# Altium schematic sheet 28Pins_Project_V1I1 Project.SchDoc
size A3; DocumentNumber: 5; SheetNumber: 5; SheetTotal: 5; PageSetup: Record=PageOptions|CenterHorizontal=True|CenterVertical=True|PrintScale=1.07|XCorrection=1.00|YCorrection=1.00|PrintKind=1|BorderSize=5000000|LeftOffset=0|BottomOffset=0|Orientation=2|PaperLength=1000|PaperWidth=1000|Scale=100|PaperSource=7|PrintQuality=600|MediaType=1|DitherType=10|PaperKind=A3|PrintScaleMode=1
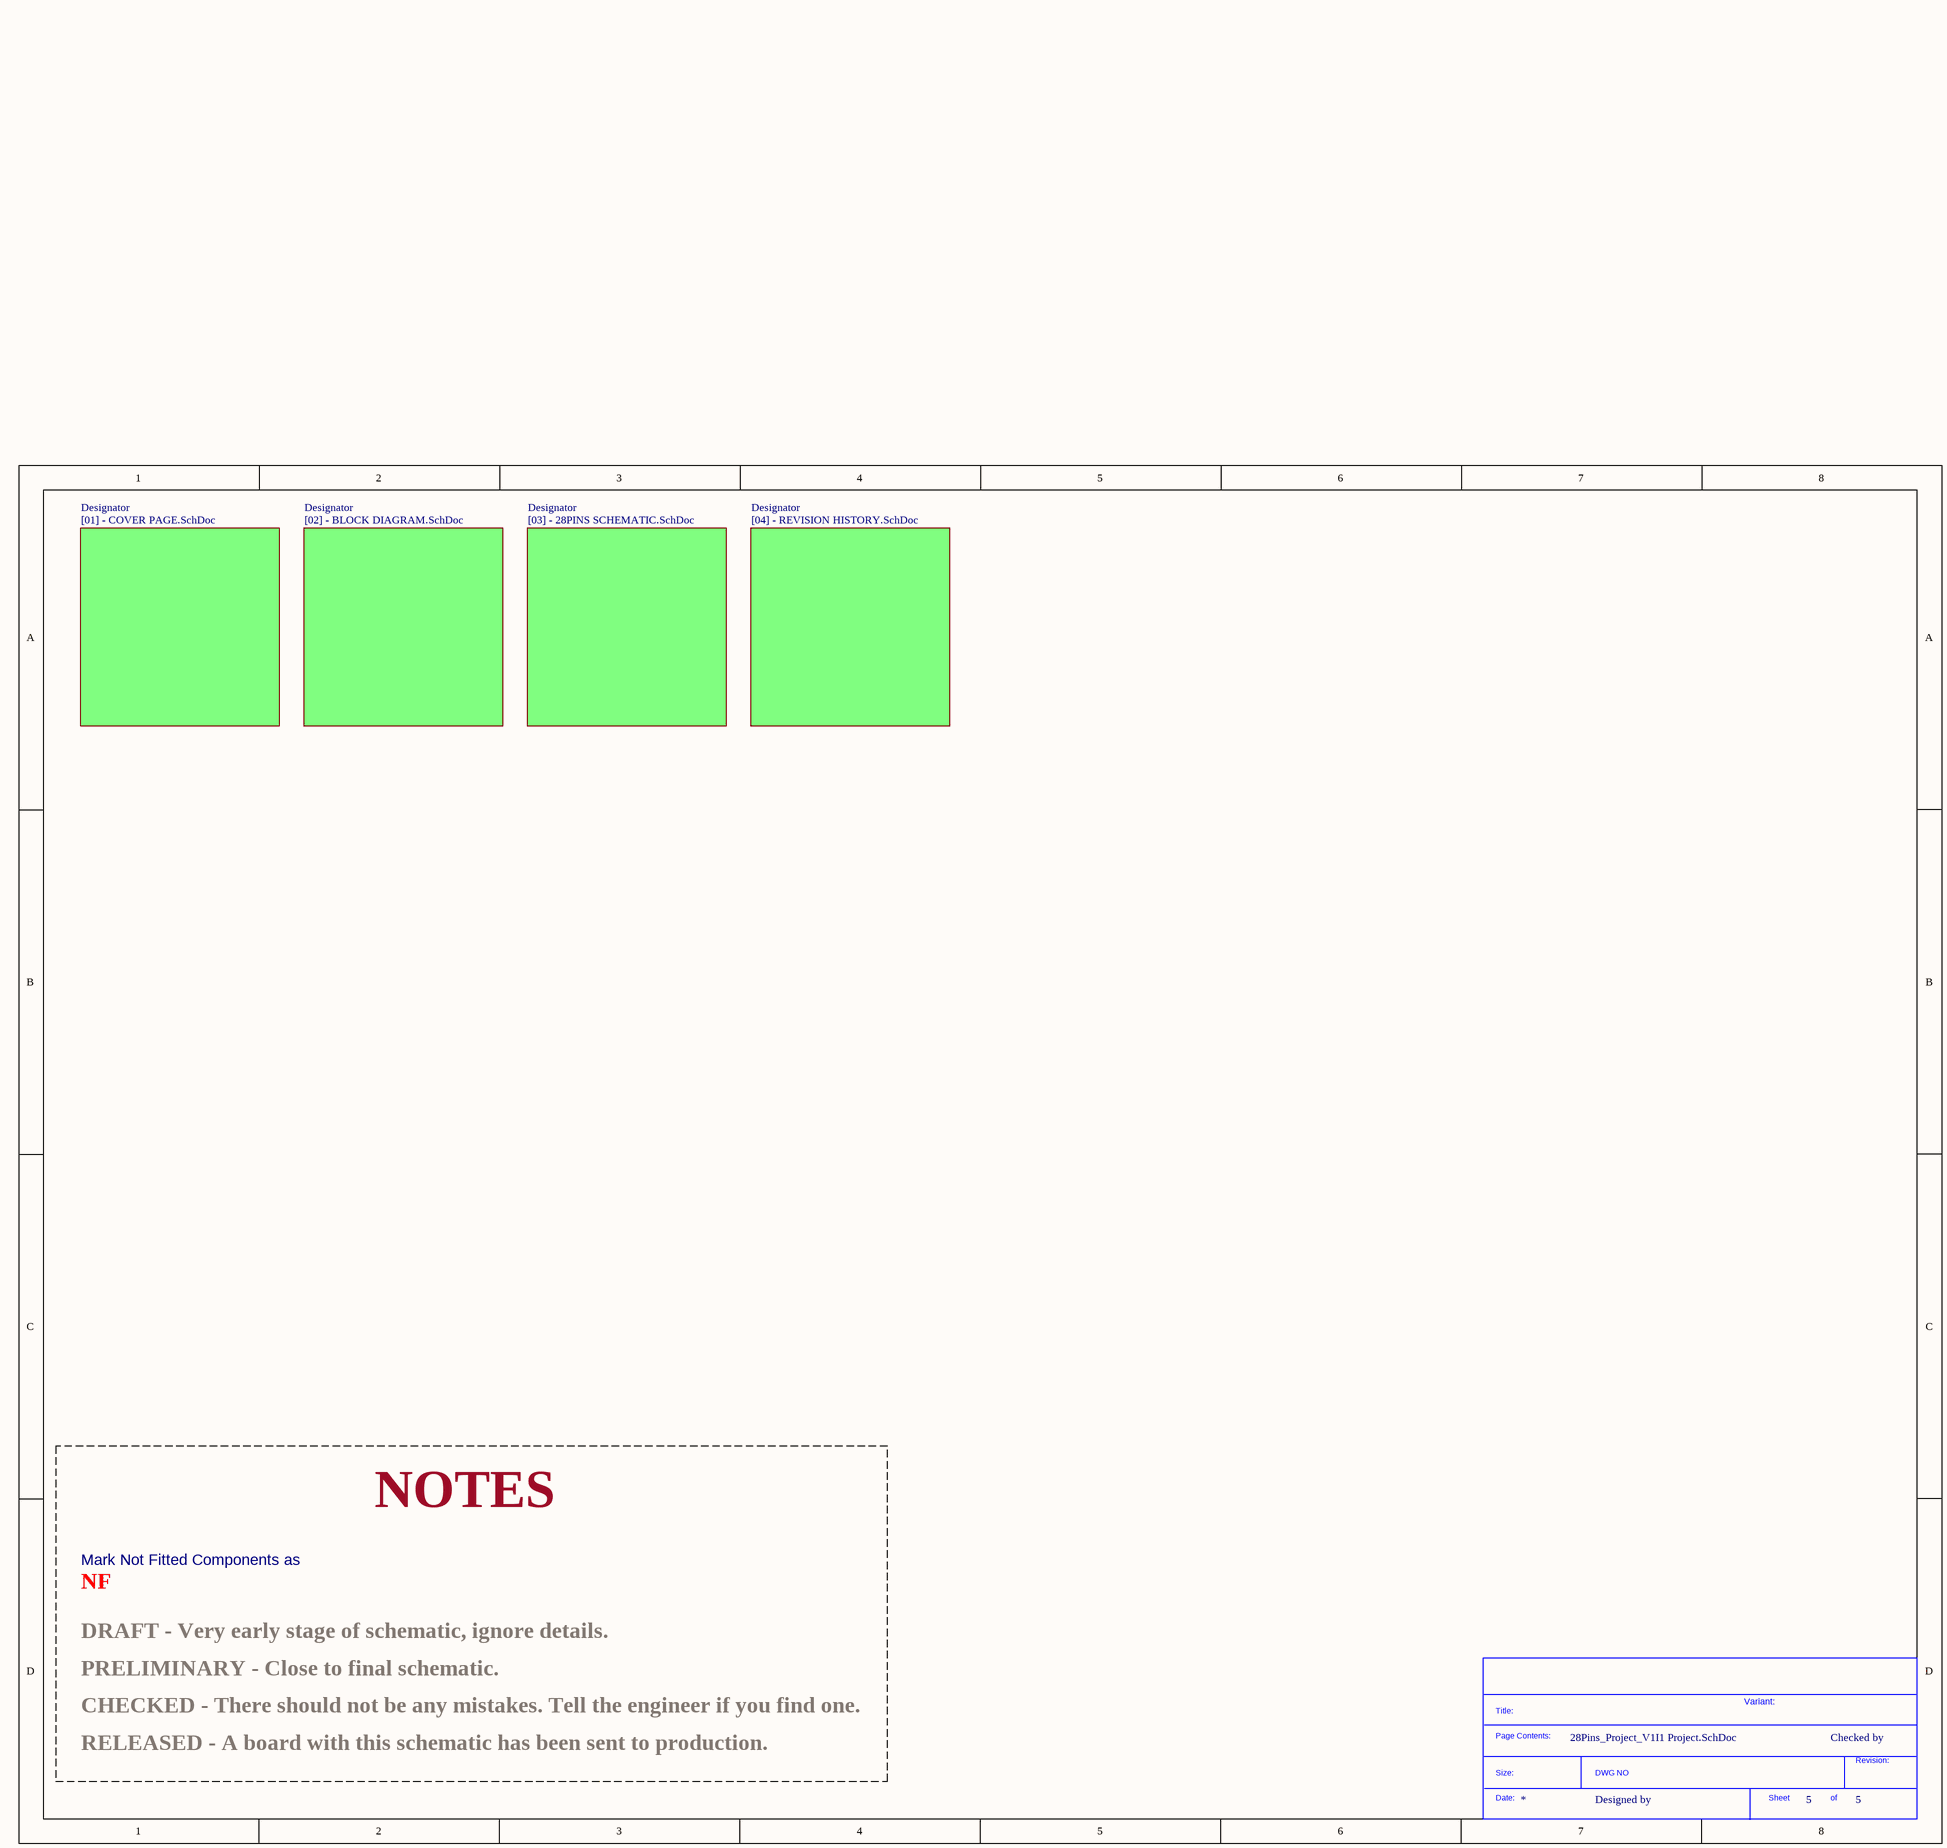
[diagram p0: 28Pins_Project_V1I1 Project.SchDoc]

## Parts
*?  SDTitleBlock  (value not drawn)  (graphical)

## Sub-sheets
Designator = [01] - COVER PAGE.SchDoc: no entries
Designator = [02] - BLOCK DIAGRAM.SchDoc: no entries
Designator = [04] - REVISION HISTORY.SchDoc: no entries
Designator = [03] - 28PINS SCHEMATIC.SchDoc: no entries

## Notes on the sheet
- NOTES
- NF
- Mark Not Fitted Components as
- PRELIMINARY - Close to final schematic.
- DRAFT - Very early stage of schematic, ignore details.
- CHECKED - There should not be any mistakes. Tell the engineer if you find one.
- Variant:
- Checked by
- RELEASED - A board with this schematic has been sent to production.
- Designed by
- (in symbol SDTitleBlock) Title:; Page Contents:; Revision:; Size:; DWG NO; Date:; Sheet; of